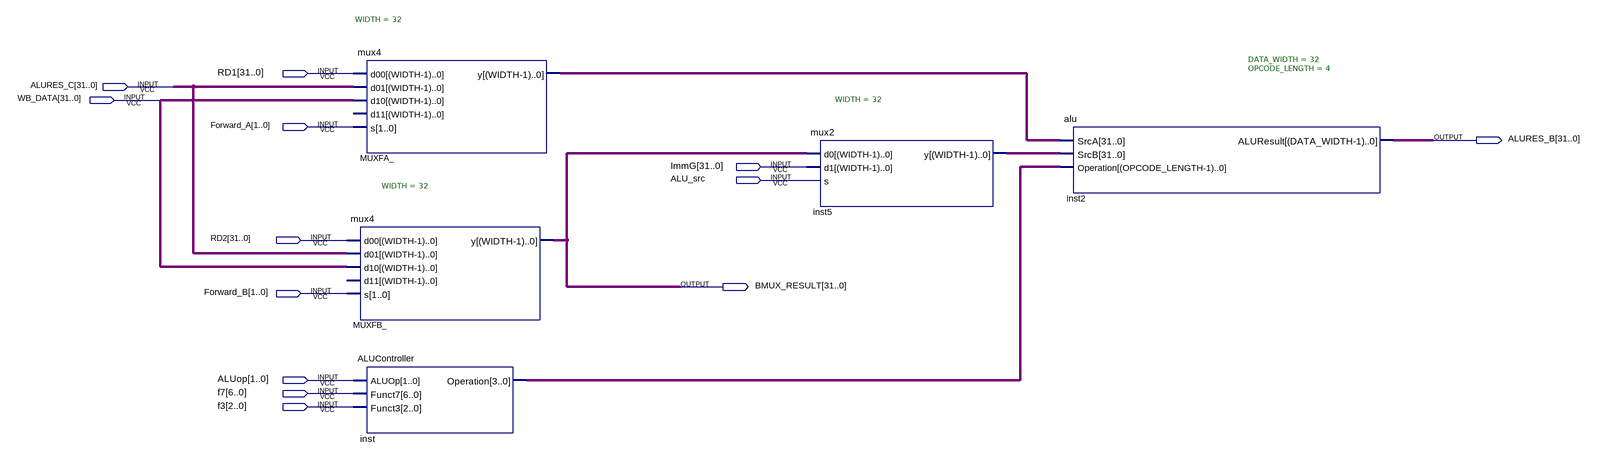
[diagram p0: schematic sheet]
// Quartus schematic BlockALU.bdf as structural Verilog: 5 symbols, 13 pins
module BlockALU (
  input  [31:0] RD1,
  input  [31:0] ALURES_C,
  input  [31:0] WB_DATA,
  input  [1:0] Forward_A,
  input  [31:0] ImmG,
  input  ALU_src,
  input  [31:0] RD2,
  input  [1:0] Forward_B,
  input  [1:0] ALUop,
  input  [6:0] f7,
  input  [2:0] f3,
  output [31:0] ALURES_B,
  output [31:0] BMUX_RESULT
);

  wire [3:0] inst_operation;
  wire [31:0] inst5_y, MUXFA__y;

  mux4 #(.WIDTH(32)) MUXFA_ (.d00(RD1), .d01(ALURES_C), .d10(WB_DATA), .s(Forward_A), .y(MUXFA__y));  // open: d11
  mux4 #(.WIDTH(32)) MUXFB_ (.d00(RD2), .d01(ALURES_C), .d10(WB_DATA), .s(Forward_B), .y(BMUX_RESULT));  // open: d11
  ALUController inst (.ALUOp(ALUop), .Funct7(f7), .Funct3(f3), .Operation(inst_operation));
  mux2 #(.WIDTH(32)) inst5 (.d0(BMUX_RESULT), .d1(ImmG), .s(ALU_src), .y(inst5_y));
  alu #(.DATA_WIDTH(32), .OPCODE_LENGTH(4)) inst2 (
    .SrcA(MUXFA__y), .SrcB(inst5_y), .Operation(inst_operation), .ALUResult(ALURES_B));
endmodule
